# Altium schematic sheet DACs.SchDoc: FMC_ADC
size 420 x 297 mm; Author: G.Kasprowicz; CompanyName: WUT ISE; DrawnBy: G.Kasprowicz; Organization: WUT ISE; Address1: PW ISE; Address2: Nowowiejska 15/19 00-665 Warsaw; Address3: gkasprow@gmail.com; DocumentNumber: 11; Revision: 2; SheetNumber: 11; SheetTotal: 12; ModifiedBy: -; CheckedDate: -; Title2: CFD Offset DAC; DivGrp: WUT ISE; Designer: G.Kasprowicz; ModifiedDate: -; ProjectName: Sensor Box
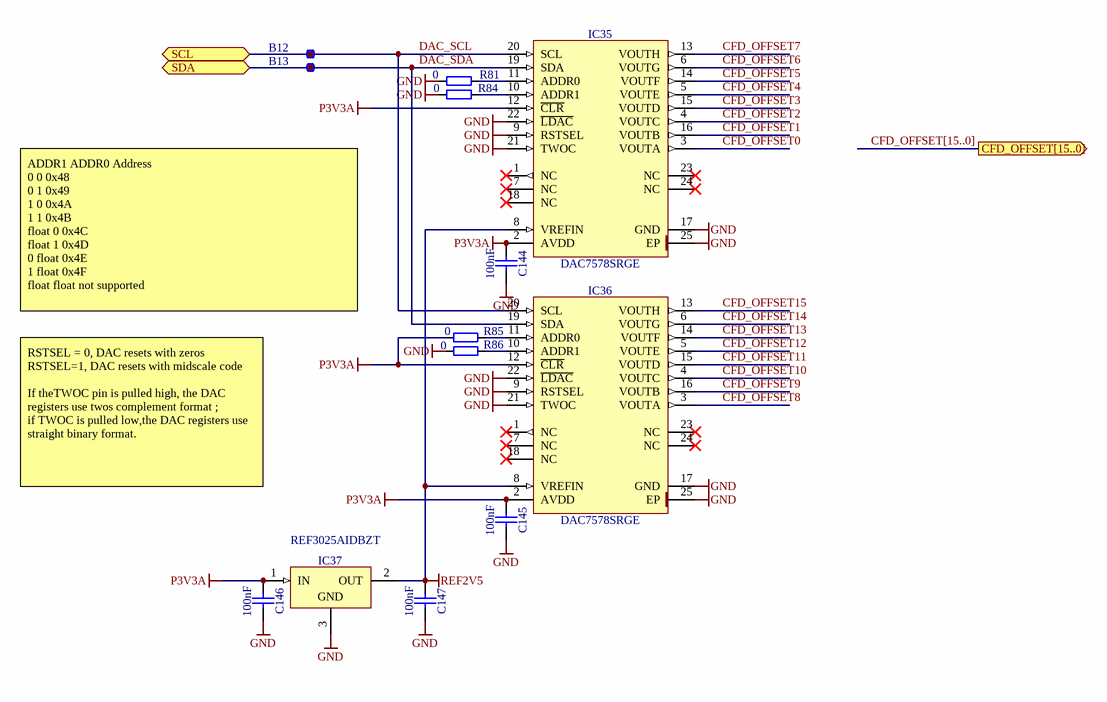
[diagram p0: DACs.SchDoc]

## Parts
B12  SMD Pad  [C100]  (value not drawn)
B13  SMD Pad  [C100]  (value not drawn)
C144  100nF  [CAPC0603X33N]
C145  100nF  [CAPC0603X33N]
C146  100nF  [CAPC0603X33N]
C147  100nF  [CAPC0603X33N]
IC35  DAC7578SRGE  [QFN50P400X400X100-25N-S280]
IC36  DAC7578SRGE  [QFN50P400X400X100-25N-S280]
IC37  REF3025AIDBZT  [SOT95P237X112-3N]
R81  0  [RESC1005X40N]
R84  0  [RESC1005X40N]
R85  0  [RESC1005X40N]
R86  0  [RESC1005X40N]

## Ports
CFD_OFFSET[15..0] (out), SCL (bidir), SDA (bidir)

## Nets
GND: C144.2 C145.2 C146.2 C147.2 IC35.9(RSTSEL) IC35.17(GND) IC35.21(TWOC) IC35.22(~{LDAC}) IC35.25(EP) IC36.9(RSTSEL) IC36.17(GND) IC36.21(TWOC) IC36.22(~{LDAC}) IC36.25(EP) IC37.3(GND) R81.1 R84.1 R86.1
P3V3A: C144.1 C145.1 C146.1 IC35.2(AVDD) IC35.12(~{CLR}) IC36.2(AVDD) IC36.12(~{CLR}) IC37.1(IN) R85.1
REF2V5: C147.1 IC35.8(VREFIN) IC36.8(VREFIN) IC37.2(OUT)
CFD_OFFSET0: IC35.3(VOUTA)
CFD_OFFSET1: IC35.16(VOUTB)
CFD_OFFSET2: IC35.4(VOUTC)
CFD_OFFSET3: IC35.15(VOUTD)
CFD_OFFSET4: IC35.5(VOUTE)
CFD_OFFSET5: IC35.14(VOUTF)
CFD_OFFSET6: IC35.6(VOUTG)
CFD_OFFSET7: IC35.13(VOUTH)
CFD_OFFSET8: IC36.3(VOUTA)
CFD_OFFSET9: IC36.16(VOUTB)
CFD_OFFSET10: IC36.4(VOUTC)
CFD_OFFSET11: IC36.15(VOUTD)
CFD_OFFSET12: IC36.5(VOUTE)
CFD_OFFSET13: IC36.14(VOUTF)
CFD_OFFSET14: IC36.6(VOUTG)
CFD_OFFSET15: IC36.13(VOUTH)
DAC_SCL: B12.1 IC35.20(SCL) IC36.20(SCL) ; port SCL
DAC_SDA: B13.1 IC35.19(SDA) IC36.19(SDA) ; port SDA
NetIC35_10: IC35.10(ADDR1) R84.2
NetIC35_11: IC35.11(ADDR0) R81.2
NetIC36_10: IC36.10(ADDR1) R86.2
NetIC36_11: IC36.11(ADDR0) R85.2

Not connected (* = marked no-connect by the designer): IC35 1(NC)* 7(NC)* 18(NC)* 23(NC)* 24(NC)*; IC36 1(NC)* 7(NC)* 18(NC)* 23(NC)* 24(NC)*

## Buses and harness runs
bus CFD_OFFSET[15..0] = port CFD_OFFSET[15..0]

## Notes on the sheet
- ADDR1	ADDR0	Address
  0	0	0x48
  0	1	0x49
  1	0	0x4A
  1	1	0x4B
  float	0	0x4C
  float	1	0x4D
  0	float	0x4E
  1	float	0x4F
  float	float	not supported
- RSTSEL = 0, DAC resets with zeros
  RSTSEL=1, DAC resets with midscale code
  If theTWOC pin is pulled high, the DAC registers use twos complement format ;
  if TWOC is pulled low,the DAC registers use straight binary format.
- Project/Equipment
- Document
- Designer
- Drawn by
- Check.by
- Copyright WUT ISE 2018.
  This documentation describes Open Hardware and is licensed under the CERN OHL v.1.1. You may redistribute and modify this documentation under the terms of the CERN OHL v.1.1. (http://ohwr.org/CERNOHL). This documentation is distributed WITHOUT ANY EXPRESS OR IMPLIED WARRANTY, INCLUDING OF MERCHANTABILITY, SATISFACTORY QUALITY AND FITNESS FOR A PARTICULAR PURPOSE. Please see the CERN OHL v.1.1 for applicable conditions.
- Contact
- File
- Last Mod.
- Print Date
- Sheet
- Size
- A3
- of
- Rev

## Library data of the parts
B12 B13 = SMD_PAD_D1MM: Through Hole Pad; Part Description: 1mm Diameter SMD Pad; Mounted: No; Part Number: SMD_PAD_D1MM; Component Kind: Standard (No BOM); Component Type: Standard (No BOM); Pin Count: 1; Family: SMD Pad; Socket: No; SMD: No; Sense: No; Status: None; ComponentHeight: 0mm; HelpURL: Undefined; Author: CERN DEM JLC; CreateDate: 10.10.2017; LatestRevisionDate: 10.10.2017; PackageDescription: 1mm Diameter SMD Pad
C144-C147 = CC0201_100NF_6.3V_10%_X5R: Non-polarised capacitor; Part Description: SMD Multilayer Chip Ceramic Capacitor; Manufacturer: GENERIC; Manufacturer1 Part Number: 02016D104KAT2A; Voltage: 6.3V; TC: X5R; Tolerance: ±10%; Part Number: CC0201_100NF_6.3V_10%_X5R; Component Kind: Standard; Component Type: Standard; Pin Count: 2; Value: 100nF; Status: Not Recommended; Manufacturer Part Number: CC0201_100NF_6.3V_10%_X5R; Case: 0201; Mounted: Yes; Socket: No; SMD: Yes; Sense: No; Manufacturer1 Example: AVX; Manufacturer1 ComponentHeight: 0.33mm; HelpURL: \\cern.ch\dfs\Applications\Altium\Datasheets\CC0201_X5R_AVX.pdf; Author: CERN DEM JLC; CreateDate: 03.12.2007; LatestRevisionDate: 03.12.2007
IC35 IC36 = DAC7578SRGE: 8-Bit, Octal-Channel, Ultra-Low Glitch, Voltage Output, Two-Wire Interface Digital-to-Analog Converter; Part Description: 12-Bit, Octal-Channel, Ultra-Low Glitch, Voltage Output, Two-Wire Interface Digital-To-Analog Converters; Manufacturer: TEXAS INSTRUMENTS; PressFit: No; Bonding: No; Part Number: DAC7578SRGE; Component Kind: Standard; Component Type: Standard; Device: DAC7578SRGE; PackageDescription: QFN, 0.50mm Pitch, Square; 24 Pin, 4.00mm L X 4.00mm W X 1.00mm H body(w/thermal tab 2.8 X 2.8mm), IPC Medium Density; Manufacturer Part Number: DAC7578SRGE; Pin Count: 25; Case: QFN24; Mounted: Yes; Socket: No; SMD: Yes; Sense: No; ComponentHeight: 1mm; Author: CERN DEM MR; HelpURL: \\cern.ch\dfs\Applications\Altium\Datasheets\DAC7578SRGE.pdf; CreateDate: 14.07.2016; LatestRevisionDate: 14.07.2016
IC37 = REF3025AIDBZT: 3-Terminal Regulator 1=IN 2=OUT 3=GND; Part Description: 2.5V, 50ppm/°C Max, 50uA, CMOS Voltage Reference; Manufacturer: TEXAS INSTRUMENTS; PressFit: No; Bonding: No; Part Number: REF3025AIDBZT; Component Kind: Standard; Component Type: Standard; Device: REF3025AIDBZT; PackageDescription: SOT, 0.95mm, pitch; 3 pin,1.30mm W X 2.92mm L X 1.12mm H body, IPC Medium Density; Manufacturer Part Number: REF3025AIDBZT; Pin Count: 3; Case: SOT23; Mounted: Yes; Socket: No; SMD: Yes; Sense: No; ComponentHeight: 1.12mm; HelpURL: \\cern.ch\dfs\Applications\Altium\Datasheets\REF3025AIDBZT.pdf; Author: CERN DEM JLC; CreateDate: 19.12.2016; LatestRevisionDate: 19.12.2016
R81 R84-R86 = R0402_0R_JUMPER: Resistor; Part Description: 1A (0.05R Max DC Resistance) Zero Ohm Jumper; Manufacturer: GENERIC; Manufacturer1 Part Number: 232270591001L; PressFit: No; Part Number: R0402_0R_JUMPER; Component Kind: Standard; Component Type: Standard; Pin Count: 2; Value: 0; Status: Not Recommended; Manufacturer Part Number: R0402_0R_JUMPER; Case: 0402; Mounted: Yes; Sense: No; Socket: No; SMD: Yes; Manufacturer1 Example: YAGEO PHYCOMP; Manufacturer1 ComponentHeight: 0.4mm; HelpURL: \\cern.ch\dfs\Applications\Altium\Datasheets\R0402_Phycomp_RC0402.pdf; Author: CERN DEM JLC; CreateDate: 03.12.2007; LatestRevisionDate: 17.10.2012